# Altium project Proto Recepteur.PrjPCB
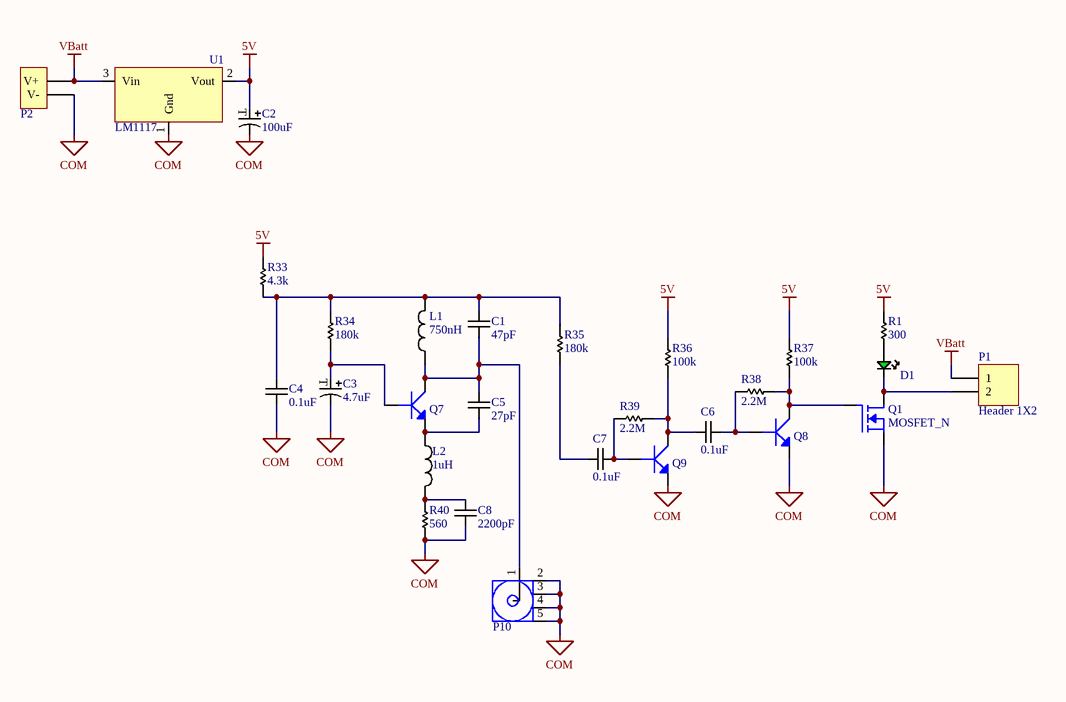
[diagram p0: Proto Recepteur.SchDoc]
1 sheet, 28 parts. Net scope: global (net labels, ports and power ports of the same name join across sheets).
Board file: Proto Recepteur.PcbDoc

## Sheet Proto Recepteur.SchDoc
size A4

### Parts
C1  value 47pF  [0805 - Cap Non-Polarized]  (hidden comment: Cap)
C2  value 100uF  [Tantalum - Case C]  (hidden comment: Cap Tantal)
C3  value 4.7uF  [Tantalum - Case D]  (hidden comment: Cap Tantal)
C4  value 0.1uF  [0805 - Cap Non-Polarized]  (hidden comment: Cap)
C5  value 27pF  [0805 - Cap Non-Polarized]  (hidden comment: Cap)
C6  value 0.1uF  [0805 - Cap Non-Polarized]  (hidden comment: Cap)
C7  value 0.1uF  [0805 - Cap Non-Polarized]  (hidden comment: Cap)
C8  value 2200pF  [0805 - Cap Non-Polarized]  (hidden comment: Cap)
D1  Green  [0805 - Led Green]  (value not drawn)
L1  value 750nH  [1008 - INDUCTOR]  (hidden comment: Inductor)
L2  value 1uH  [1008 - INDUCTOR]  (hidden comment: Inductor)
P1  Header 1X2  [Headers - 1x2 - R/A - Lock]
P2  Battery Holder  [Battery Holder - 9V - THT]  (value not drawn)
P10  Coax-F  [SMA-Female-R/A-THT]  (value not drawn)
Q1  MOSFET_N  [SOT23-3]
Q7  NPN  [SOT23-3]  (value not drawn)
Q8  NPN  [SOT23-3]  (value not drawn)
Q9  NPN  [SOT23-3]  (value not drawn)
R1  value 300  [0805 - Resistor]  (hidden comment: Res)
R33  value 4.3k  [0805 - Resistor]  (hidden comment: Res)
R34  value 180k  [0805 - Resistor]  (hidden comment: Res)
R35  value 180k  [0805 - Resistor]  (hidden comment: Res)
R36  value 100k  [0805 - Resistor]  (hidden comment: Res)
R37  value 100k  [0805 - Resistor]  (hidden comment: Res)
R38  value 2.2M  [0805 - Resistor]  (hidden comment: Res)
R39  value 2.2M  [0805 - Resistor]  (hidden comment: Res)
R40  value 560  [0805 - Resistor]  (hidden comment: Res)
U1  LM1117  [SOT223-3]

### Nets
5V: C2.1 R1.2 R33.2 R36.1 R37.1 U1.2(Vout)
COM: C2.2 C3.2 C4.1 C8.1 P2.2(V-) P10.2(GND) P10.3(GND) P10.4(GND) P10.5(GND) Q1.2(S) Q8.2(E) Q9.2(E) R40.1 U1.1(Gnd)
VBatt: P1.1 P2.1(V+) U1.3(Vin)
NetC1_1: C1.1 C5.2 L1.1 P10.1(Signal) Q7.3(C)
NetC1_2: C1.2 C4.2 L1.2 R33.1 R34.1 R35.2
NetC3_1: C3.1 Q7.1(B) R34.2
NetC5_1: C5.1 L2.1 Q7.2(E)
NetC6_1: C6.1 Q8.1(B) R38.1
NetC6_2: C6.2 Q9.3(C) R36.2 R39.2
NetC7_1: C7.1 Q9.1(B) R39.1
NetC7_2: C7.2 R35.1
NetC8_2: C8.2 L2.2 R40.2
NetD1_1: D1.1(A) R1.1
NetD1_2: D1.2(K) P1.2 Q1.3(D)
NetQ1_1: Q1.1(G) Q8.3(C) R37.2 R38.2

### Notes on the sheet
- (in symbol Kemet-T491-4.7uF-35V-1.5 Ohm) T
- (in symbol Kemet-T491-100uF-16V-1 Ohm) T

### Library data of the parts
C1 = Cap-TDK-CGA-47pF-0805: CAP CER 47PF 100V 5% NP0 0603; Manufacturer: TDK; Manufacturer No: CGA3E2C0G2A470J080AA; Sub Category: 0805; Part Number: Cap-TDK-CGA-47pF-0805; Category: Capacitor; Pin count: 2; Package: 0805; Series: CGA; Supplier 1: Digi-Key; Supplier Part Number 1: 445-12332-1-ND; ComponentLink1URL: http://product.tdk.com/capacitor/mlcc/en/documents/mlcc_automotive_midvoltage_en.pdf; ComponentLink1Description: Datasheet; Creation Date: 2013-09-25 17:50:57; Created by: Pier-Yves; Tolerance: ±5%; Height: 1.45mm; Voltage: 100V; Temperature: MLCC
C2 = Kemet-T491-100uF-16V-1 Ohm: CAP TANT 100 16V 10% 2413; Manufacturer: Kemet; Manufacturer No: T491C107K016AT; Sub Category: Tantalum; Part Number: Kemet-T491-100uF-16V-1 Ohm; Category: Capacitor; Pin count: 2; Package: 2413; Series: T491; Supplier 1: Digi-Key; Supplier Part Number 1: 399-5214-1-ND; ComponentLink1URL: http://www.kemet.com/datasheets&T491C107K016ZTZTZTZT; ComponentLink1Description: Datasheet; Creation Date: 2013-09-15 05:28:18; Created by: Frederic; Tolerance: 10%; Height: 2.80mm; Voltage: 16V; Temperature: -55°C ~ 125°C
C3 = Kemet-T491-4.7uF-35V-1.5 Ohm: CAP TANT 4.7 35V 10% 2917; Manufacturer: Kemet; Manufacturer No: T491D475K035AT; Sub Category: Tantalum; Part Number: Kemet-T491-4.7uF-35V-1.5 Ohm; Category: Capacitor; Pin count: 2; Package: 2917; Series: T491; Supplier 1: Digi-Key; Supplier Part Number 1: 399-3791-1-ND; ComponentLink1URL: http://www.kemet.com/datasheets&T491D475K035AT; ComponentLink1Description: Datasheet; Creation Date: 2013-09-15 05:28:05; Created by: Frederic; Tolerance: 10%; Height: 3.10mm; Voltage: 35V; Temperature: -55°C ~ 125°C
C4 C6 C7 = Cap-TDK-CGA-0.1uF-0805: CAP CER 0.1UF 100V 10% X7R 0805; Manufacturer: TDK; Manufacturer No: CGA4J2X7R2A104K125AA; Sub Category: 0805; Part Number: Cap-TDK-CGA-0.1uF-0805; Category: Capacitor; Pin count: 2; Package: 0805; Series: CGA; Supplier 1: Digi-Key; Supplier Part Number 1: 445-5827-1-ND; ComponentLink1URL: http://product.tdk.com/capacitor/mlcc/en/documents/mlcc_automotive_midvoltage_en.pdf; ComponentLink1Description: Datasheet; Creation Date: 2013-09-19 19:23:33; Created by: Pier-Yves; Tolerance: 10%; Height: 1.45mm; Voltage: 100V; Temperature: -55°C ~ 125°C
C5 = Cap-TDK-CGA-27pF-0805: CAP CER 27PF 50V 5% NP0 0603; Manufacturer: TDK; Manufacturer No: CGA3E2C0G1H270J080AA; Sub Category: 0805; Part Number: Cap-TDK-CGA-27pF-0805; Category: Capacitor; Pin count: 2; Package: 0805; Series: CGA; Supplier 1: Digi-Key; Supplier Part Number 1: 445-5633-1-ND; ComponentLink1URL: http://product.tdk.com/capacitor/mlcc/en/documents/mlcc_automotive_general_en.pdf; ComponentLink1Description: Datasheet; Creation Date: 2013-09-25 17:50:57; Created by: Pier-Yves; Tolerance: ±5%; Height: 1.45mm; Voltage: 50V; Temperature: MLCC
C8 = Cap-TDK-CGA-2200pF-0805: CAP CER 2200PF 100V 5% NP0 0805; Manufacturer: TDK; Manufacturer No: CGA4F2C0G2A222J085AA; Sub Category: 0805; Part Number: Cap-TDK-CGA-2200pF-0805; Category: Capacitor; Pin count: 2; Package: 0805; Series: CGA; Supplier 1: Digi-Key; Supplier Part Number 1: 445-5753-1-ND; ComponentLink1URL: http://product.tdk.com/capacitor/mlcc/en/documents/mlcc_automotive_midvoltage_en.pdf; ComponentLink1Description: Datasheet; Creation Date: 2013-09-19 19:23:33; Created by: Pier-Yves; Tolerance: 5%; Height: 1.45mm; Voltage: 100V; Temperature: MLCC
D1 = LED-Green-lowBrigthness-0805: Led Green 0805 Low Brightness - 10mA; Manufacturer: Lite-On inc.; Manufacturer No: LTST-C170GKT; Sub Category: 0805; Value: 6mcd; Voltage: 2.1V; Part Number: LED-Green-lowBrigthness-0805; Category: LED; Pin count: 2; Package: 0805; Supplier 1: Digi-Key; Supplier Part Number 1: 160-1179-1-ND; ComponentLink1URL: http://media.digikey.com/pdf/Data%20Sheets/Lite-On%20PDFs/LTST-C170GKT.pdf; ComponentLink1Description: Datasheet; Created by: Pier-Yves; Height: 1.10mm; Current: 10mA
L1 = Murata-LQW2UA-Ind-AirCore-750nH: IND 750NH 360MA SRF 360MHZ 1008; Manufacturer: Murata Electronics North America; Manufacturer No: LQW2UASR75J00L; Sub Category: SMD; Tolerance: 5%; Part Number: Murata-LQW2UA-Ind-AirCore-750nH; Category: Inductor; Pin count: 2; Package: 2520; Series: LQW2UA; Supplier 1: Digi-Key; Supplier Part Number 1: 490-5703-1-ND; ComponentLink1URL: http://search.murata.co.jp/Ceramy/image/img/PDF/ENG/L0075S0080LQW2UA.pdf; ComponentLink1Description: Datasheet; Creation Date: 2013-09-12 02:00:34; Created by: Frederic; Height: 1.83mm; Current: 360mA; Temperature: -55°C ~ 125°C
L2 = Murata-LQW2UA-Ind-AirCore-1uH: IND 1000NH 370MA SRF 290MHZ 1008; Manufacturer: Murata Electronics North America; Manufacturer No: LQW2UAS1R0J00L; Sub Category: SMD; Tolerance: 5%; Part Number: Murata-LQW2UA-Ind-AirCore-1uH; Category: Inductor; Pin count: 2; Package: 2520; Series: LQW2UA; Supplier 1: Digi-Key; Supplier Part Number 1: 490-5706-1-ND; ComponentLink1URL: http://search.murata.co.jp/Ceramy/image/img/PDF/ENG/L0075S0080LQW2UA.pdf; ComponentLink1Description: Datasheet; Creation Date: 2013-09-12 02:00:35; Created by: Frederic; Height: 1.83mm; Current: 370mA; Temperature: -55°C ~ 125°C
P1 = Header-0.100-R/A-Lock-1X2: Manufacturer: Molex Inc.; Manufacturer No: 0705530001; Sub Category: 100mils R/A lock; LatestRevisionDate: 17-Jul-2002; LatestRevisionNote: Re-released for DXP Platform.; Publisher: Altium Limited; Part Number: Header-0.100-R/A-Lock-1X2; Category: Header; Pin count: 2; Series: C-Grid® SL™ 70553; Supplier 1: Digi-Key; Supplier Part Number 1: WM4900-ND; ComponentLink1URL: http://www.molex.com/pdm_docs/sd/705530001_sd.pdf; ComponentLink1Description: Datasheet; Creation Date: 2013-06-28 14:36:17; Created by: Pier-Yves
P2 = Battery Holder-9V-THT-Open: HOLDER BATTERY 9V PC MOUNT; Manufacturer: MPD; Manufacturer No: BC9VPC; Part Number: Battery Holder-9V-THT-Open; Category: Battery Holder; Pin count: 2; Supplier 1: Digi-Key; Supplier Part Number 1: BC9VPC-ND; ComponentLink1URL: http://www.memoryprotectiondevices.com/datasheets/BC9VPC-datasheet.pdf; ComponentLink1Description: Datasheet; Creation Date: 2013-10-01 13:40:00; Created by: Pier-Yves; Value: 9V; Height: 21.41mm; Voltage: 9V
P10 = coax-sma-ra-tht: CONN SMA JACK R/A 50 OHM PCB; Manufacturer: Linx Technologies Inc.; Manufacturer No: CONSMA002; Sub Category: Coaxial; Value: 12.4GHz; Part Number: coax-sma-ra-tht; Category: Connector; Pin count: 5; Supplier 1: Digi-Key; Supplier Part Number 1: CONSMA002-ND; ComponentLink1URL: http://www.linxtechnologies.com/resources/documents/sma_rp-sma_specs.pdf; ComponentLink1Description: Datasheet; Creation Date: 2013-09-29 21:15:14; Created by: Pier-Yves; Height: 13.9mm; Temperature: -65°C ~ 165°C
Q1 = 2N7002: MosFET Channel-N SOT-23-3 3.3A; Part Number: 2N7002; Manufacturer: Vishay Siliconix; Manufacturer No: SI2304DDS-T1-GE3; Sub Category: MOSFET-N; Value: Channel N; Power: 1.7W; Voltage: 30V; Category: Transistor; Pin count: 3; Package: SOT-23-3; Series: ÉTrenchFET; Supplier 1: Digi-Key; Supplier Part Number 1: SI2304DDS-T1-GE3CT-ND; ComponentLink1URL: http://www.vishay.com/docs/65175/si2304dd.pdf; ComponentLink1Description: Datasheet; Creation Date: 2013-06-28 13:51:31; Created by: Pier-Yves; Current: 3.3A
Q7-Q9 = MMBT2222A-7-F: TRANS NPN 40V 350MW SMD SOT23-3; Manufacturer: Diodes Inc.; Sub Category: BJT NPN; Power: 300mW; Current: 600mA; Part Number: MMBT2222A-7-F; Category: Transistor; Pin count: 3; Package: SOT-23-3; Manufacturer No: MMBT2222A-7-F; Supplier 1: Digi-Key; Supplier Part Number 1: MMBT2222A-FDICT-ND; ComponentLink1URL: http://www.diodes.com/datasheets/ds30041.pdf; ComponentLink1Description: Datasheet; Creation Date: 2013-09-25 15:47:37; Created by: Pier-Yves
R1 = Yagao-RC0805-300: RES 300 OHM 1/8W 5% 0805 SMD; Manufacturer: Yagao; Manufacturer No: RC0805JR-07300RL; Sub Category: 0805; Part Number: Yagao-RC0805-300; Category: Resistor; Pin count: 2; Package: 0805; Series: RC0805; Supplier 1: Digi-Key; Supplier Part Number 1: 311-300ARCT-ND; ComponentLink1URL: http://media.digikey.com/pdf/Data%20Sheets/Yageo%20PDFs/RC0805%20Pb%20Free.pdf; ComponentLink1Description: Datasheet; Creation Date: 2013-06-28 03:21:03; Created by: Pier-Yves; Tolerance: 5%; Power: 1/8W; Height: 0.6mm
R33 = Yagao-RC0805-4.3k: RES 4.3K OHM 1/8W 5% 0805 SMD; Manufacturer: Yagao; Manufacturer No: RC0805JR-074K3L; Sub Category: 0805; Part Number: Yagao-RC0805-4.3k; Category: Resistor; Pin count: 2; Package: 0805; Series: RC0805; Supplier 1: Digi-Key; Supplier Part Number 1: 311-4.3KARCT-ND; ComponentLink1URL: http://media.digikey.com/pdf/Data%20Sheets/Yageo%20PDFs/RC0805%20Pb%20Free.pdf; ComponentLink1Description: Datasheet; Creation Date: 2013-06-28 03:21:03; Created by: Pier-Yves; Tolerance: 5%; Power: 1/8W; Height: 0.6mm
R34 R35 = Yagao-RC0805-180k: RES 180K OHM 1/8W 5% 0805 SMD; Manufacturer: Yagao; Manufacturer No: RC0805JR-07180KL; Sub Category: 0805; Part Number: Yagao-RC0805-180k; Category: Resistor; Pin count: 2; Package: 0805; Series: RC0805; Supplier 1: Digi-Key; Supplier Part Number 1: 311-180KARCT-ND; ComponentLink1URL: http://media.digikey.com/pdf/Data%20Sheets/Yageo%20PDFs/RC0805%20Pb%20Free.pdf; ComponentLink1Description: Datasheet; Creation Date: 2013-06-28 03:21:03; Created by: Pier-Yves; Tolerance: 5%; Power: 1/8W; Height: 0.6mm
R36 R37 = Yagao-RC0805-100k: RES 100K OHM 1/8W 5% 0805 SMD; Manufacturer: Yagao; Manufacturer No: RC0805JR-07100KL; Sub Category: 0805; Part Number: Yagao-RC0805-100k; Category: Resistor; Pin count: 2; Package: 0805; Series: RC0805; Supplier 1: Digi-Key; Supplier Part Number 1: 311-100KARCT-ND; ComponentLink1URL: http://media.digikey.com/pdf/Data%20Sheets/Yageo%20PDFs/RC0805%20Pb%20Free.pdf; ComponentLink1Description: Datasheet; Creation Date: 2013-06-28 03:21:03; Created by: Pier-Yves; Tolerance: 5%; Power: 1/8W; Height: 0.6mm
R38 R39 = Yagao-RC0805-2.2M: RES 2.2M OHM 1/8W 5% 0805 SMD; Manufacturer: Yagao; Manufacturer No: RC0805JR-072M2L; Sub Category: 0805; Part Number: Yagao-RC0805-2.2M; Category: Resistor; Pin count: 2; Package: 0805; Series: RC0805; Supplier 1: Digi-Key; Supplier Part Number 1: 311-2.2MARCT-ND; ComponentLink1URL: http://media.digikey.com/pdf/Data%20Sheets/Yageo%20PDFs/RC0805%20Pb%20Free.pdf; ComponentLink1Description: Datasheet; Creation Date: 2013-06-28 03:21:03; Created by: Pier-Yves; Tolerance: 5%; Power: 1/8W; Height: 0.6mm
R40 = Yagao-RC0805-560: RES 560 OHM 1/8W 5% 0805 SMD; Manufacturer: Yagao; Manufacturer No: RC0805JR-07560RL; Sub Category: 0805; Part Number: Yagao-RC0805-560; Category: Resistor; Pin count: 2; Package: 0805; Series: RC0805; Supplier 1: Digi-Key; Supplier Part Number 1: 311-560ARCT-ND; ComponentLink1URL: http://media.digikey.com/pdf/Data%20Sheets/Yageo%20PDFs/RC0805%20Pb%20Free.pdf; ComponentLink1Description: Datasheet; Creation Date: 2013-06-28 03:21:03; Created by: Pier-Yves; Tolerance: 5%; Power: 1/8W; Height: 0.6mm
U1 = LM1117 5v SOT223-3: Regulator LDO 5V; Manufacturer: Texas Instrument; Manufacturer No: LM1117IMPX-5.0/NOPB; Sub Category: Linear Regulator; Voltage: 6.2V - 15V; Current: 800mA; Part Number: LM1117 5v SOT223-3; Category: IC; Pin count: 3; Package: SOT223-3; Supplier 1: Digi-Key; Supplier Part Number 1: LM1117IMPX-5.0/NOPBCT-ND; ComponentLink1URL: http://www.ti.com/lit/ds/symlink/lm1117-n.pdf; ComponentLink1Description: Datasheet; Creation Date: 2013-04-24 11:22:31; Created by: Pier-Yves; Value: 5V; Temperature: -40°C ~ 125°C